# Altium schematic sheet CAN.SchDoc
size A4; SheetNumber: 2; SheetTotal: 11
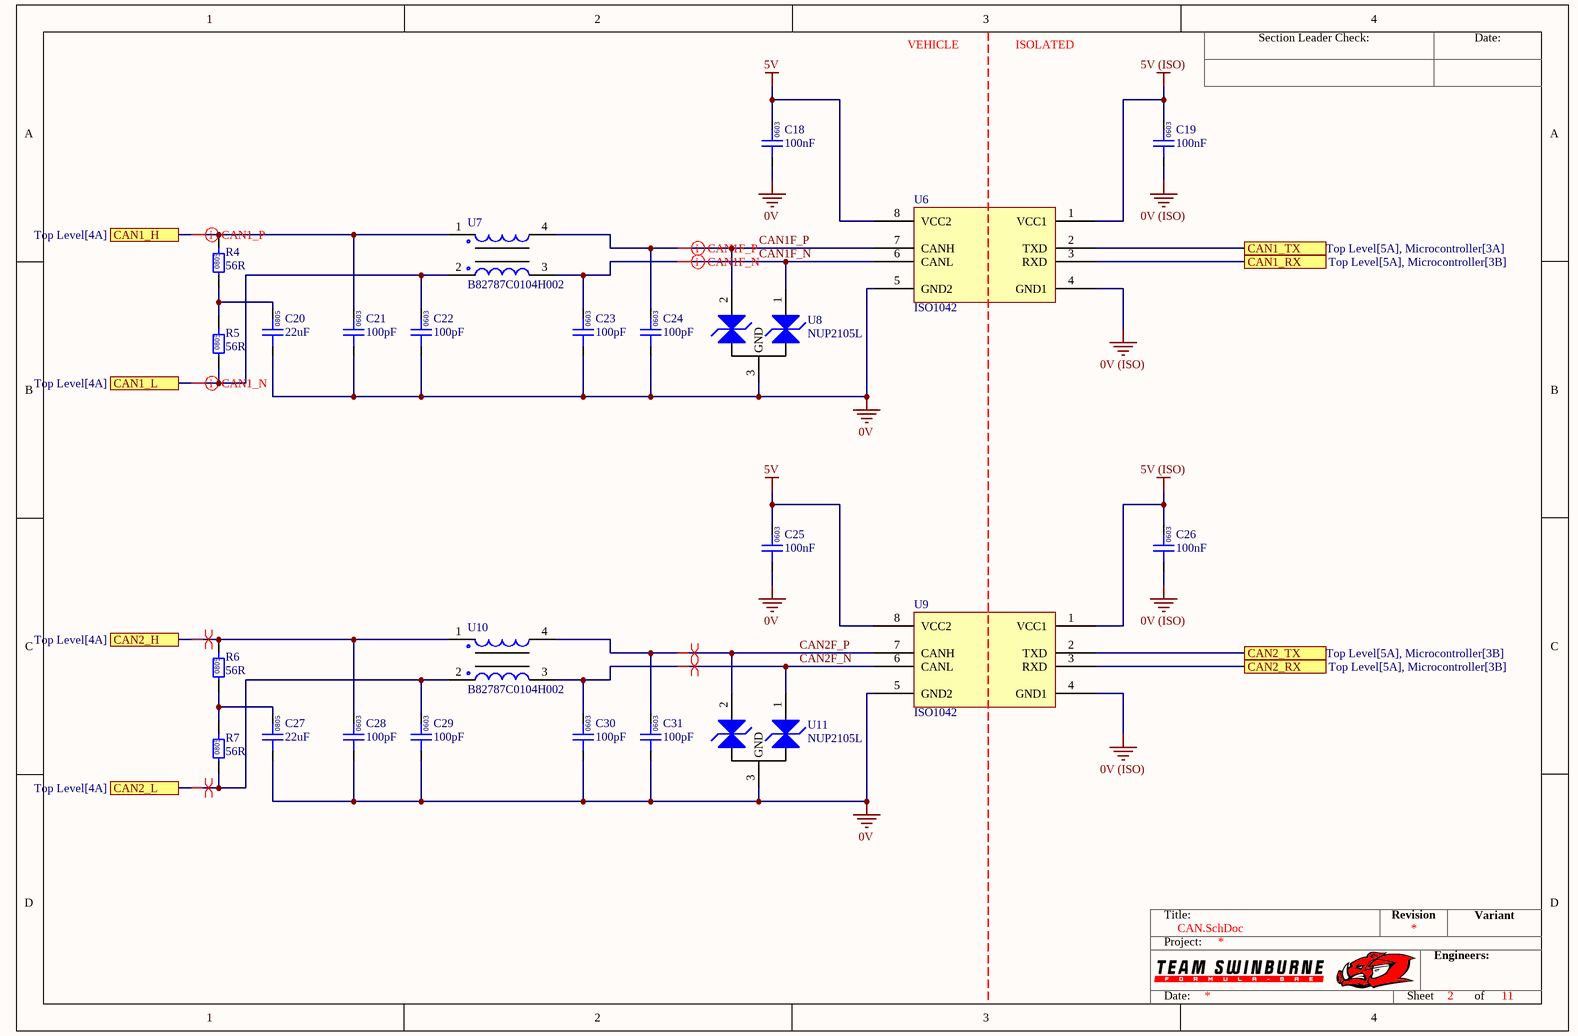
[diagram p0: CAN.SchDoc]

## Parts
C18  100nF  [0603]
C19  100nF  [0603]
C20  22uF  [0805]
C21  100pF  [0603]
C22  100pF  [0603]
C23  100pF  [0603]
C24  100pF  [0603]
C25  100nF  [0603]
C26  100nF  [0603]
C27  22uF  [0805]
C28  100pF  [0603]
C29  100pF  [0603]
C30  100pF  [0603]
C31  100pF  [0603]
R4  56R  [0805]
R5  56R  [0805]
R6  56R  [0805]
R7  56R  [0805]
U6  ISO1042  [TI-SOIC-8]
U7  B82787C0104H002  [TDK 4-PC Pad]
U8  NUP2105L  [ON SOT-23]
U9  ISO1042  [TI-SOIC-8]
U10  B82787C0104H002  [TDK 4-PC Pad]
U11  NUP2105L  [ON SOT-23]

## Ports
CAN1_H (see Top Level[4A]), CAN1_L (see Top Level[4A]), CAN1_RX (see Top Level[5A], Microcontroller[3B]), CAN1_TX (see Top Level[5A], Microcontroller[3A]), CAN2_H (see Top Level[4A]), CAN2_L (see Top Level[4A]), CAN2_RX (see Top Level[5A], Microcontroller[3B]), CAN2_TX (see Top Level[5A], Microcontroller[3B])

## Nets
0V: C18.1 C20.1 C21.1 C22.1 C23.1 C24.1 C25.1 C27.1 C28.1 C29.1 C30.1 C31.1 U6.5(GND2) U8.3(GND) U9.5(GND2) U11.3(GND)
0V (ISO): C19.1 C26.1 U6.4(GND1) U9.4(GND1)
5V: C18.2 C25.2 U6.8(VCC2) U9.8(VCC2)
5V (ISO): C19.2 C26.2 U6.1(VCC1) U9.1(VCC1)
CAN1_H: C21.2 R4.2 U7.1 ; port CAN1_H
CAN1_L: C22.2 R5.1 U7.2 ; port CAN1_L
CAN1_RX: U6.3(RXD) ; port CAN1_RX
CAN1_TX: U6.2(TXD) ; port CAN1_TX
CAN1F_N: C23.2 U6.6(CANL) U7.3 U8.1(CAN_H)
CAN1F_P: C24.2 U6.7(CANH) U7.4 U8.2(CAN_L)
CAN2_H: C28.2 R6.2 U10.1 ; port CAN2_H
CAN2_L: C29.2 R7.1 U10.2 ; port CAN2_L
CAN2_RX: U9.3(RXD) ; port CAN2_RX
CAN2_TX: U9.2(TXD) ; port CAN2_TX
CAN2F_N: C30.2 U9.6(CANL) U10.3 U11.1(CAN_H)
CAN2F_P: C31.2 U9.7(CANH) U10.4 U11.2(CAN_L)
NetC20_2: C20.2 R4.1 R5.2
NetC27_2: C27.2 R6.1 R7.2

## Layout directives
differential pair: CAN1_H, CAN1_L, CAN1F_N, CAN1F_P, CAN2_H, CAN2_L, CAN2F_N, CAN2F_P

## Notes on the sheet
- VEHICLE
- ISOLATED
- Section Leader Check:
- Date:
- Title:
- Revision
- Variant
- Project:
- Engineers:
- Sheet
- of
- (in symbol GCM188L81H104KA57D) 0603
- (in symbol GRM21BR61A226ME51L) 0805
- (in symbol GRM1885C1H101JA01D) 0603
- (in symbol RC0805FR0756RL) 0805

## Library data of the parts
C18 C19 C25 C26 = GCM188L81H104KA57D: Manufacturer: muRata; Rated Voltage: 50V; Tolerance: ±10%; Material: MLCC; Temperature Rating: X8L; Part Number: GCM188L81H104KA57D; Value: 100nF; Digikey Part Number: 490-6049-1-ND
C20 C27 = GRM21BR61A226ME51L: Manufacturer: muRata; Rated Voltage: 10V; Tolerance: 20%; Material: MLCC; Temperature Rating: X5R; Part Number: GRM21BR61A226ME51L; Value: 22uF; Digikey Part Number: 490-10511-1-ND
C21-C24 C28-C31 = GRM1885C1H101JA01D: Manufacturer: Murata Electronics; Rated Voltage: 50V; Tolerance: ±5%; Material: MLCC; Temperature Rating: C0G, NP0; Part Number: GRM1885C1H101JA01D; Value: 100pF; Digikey Part Number: 490-1427-1-ND
R4-R7 = RC0805FR0756RL: Manufacturer: YAGEO; Tolerance: 0.01; Rated Power: 0.125W; Part Number: RC0805FR0756RL; Value: 56R; Material: FR-07; Digikey Part Number: 311-56.0CRCT-ND
U6 U9 = ISO1042: IC CAN TRANSCEIVER 1/1 8SOIC; Manufacturer: Texas Instruments; Part Number: ISO1042; Digikey Part Number: 296-ISO1042BQDWVQ1-ND
U7 U10 = B82787C0104H002: Manufacturer: EPCOS (TDK); Value: 100µH @ 100kHz; Impedance: 5.8 kOhms @ 10MHz; Rated Current: 150mA; Part Number: B82787C0104H002; Material: Wirewound; Digikey Part Number: 495-4598-1-ND
U8 U11 = NUP2105L: Dual Line CAN Bus Protector; Manufacturer: ON Semiconductor; Part Number: NUP2105L; Digikey Part Number: NUP2105LT1GOSCT-ND; Digikey Link: https://www.digikey.com/product-detail/en/on-semiconductor/NUP2105LT1G/NUP2105LT1GOSCT-ND/1485001